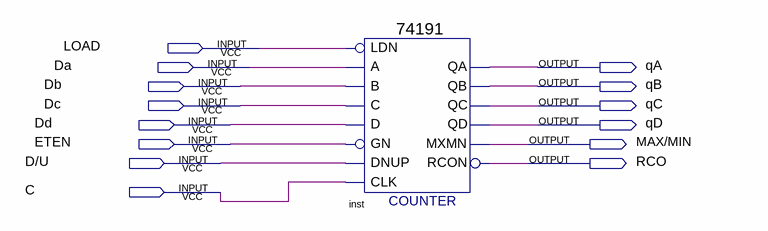
[diagram p0: schematic sheet]
// Quartus schematic kp15533IE13.bdf as structural Verilog: 1 symbols, 14 pins
module kp15533IE13 (
  input  LOAD,
  input  Da,
  input  Db,
  input  Dc,
  input  Dd,
  input  ETEN,
  input  \D/U ,
  input  C,
  output qA,
  output qB,
  output qC,
  output qD,
  output \MAX/MIN ,
  output RCO
);

  \74191  inst (
    .LDN(LOAD), .D(Dd), .C(Dc), .B(Db), .A(Da), .CLK(C), .DNUP(\D/U ), .GN(ETEN), .RCON(RCO),
    .MXMN(\MAX/MIN ), .QA(qA), .QB(qB), .QD(qD), .QC(qC));
endmodule
